# Altium schematic sheet ECG.SchDoc
size A4; SheetNumber: 4; SheetTotal: 7
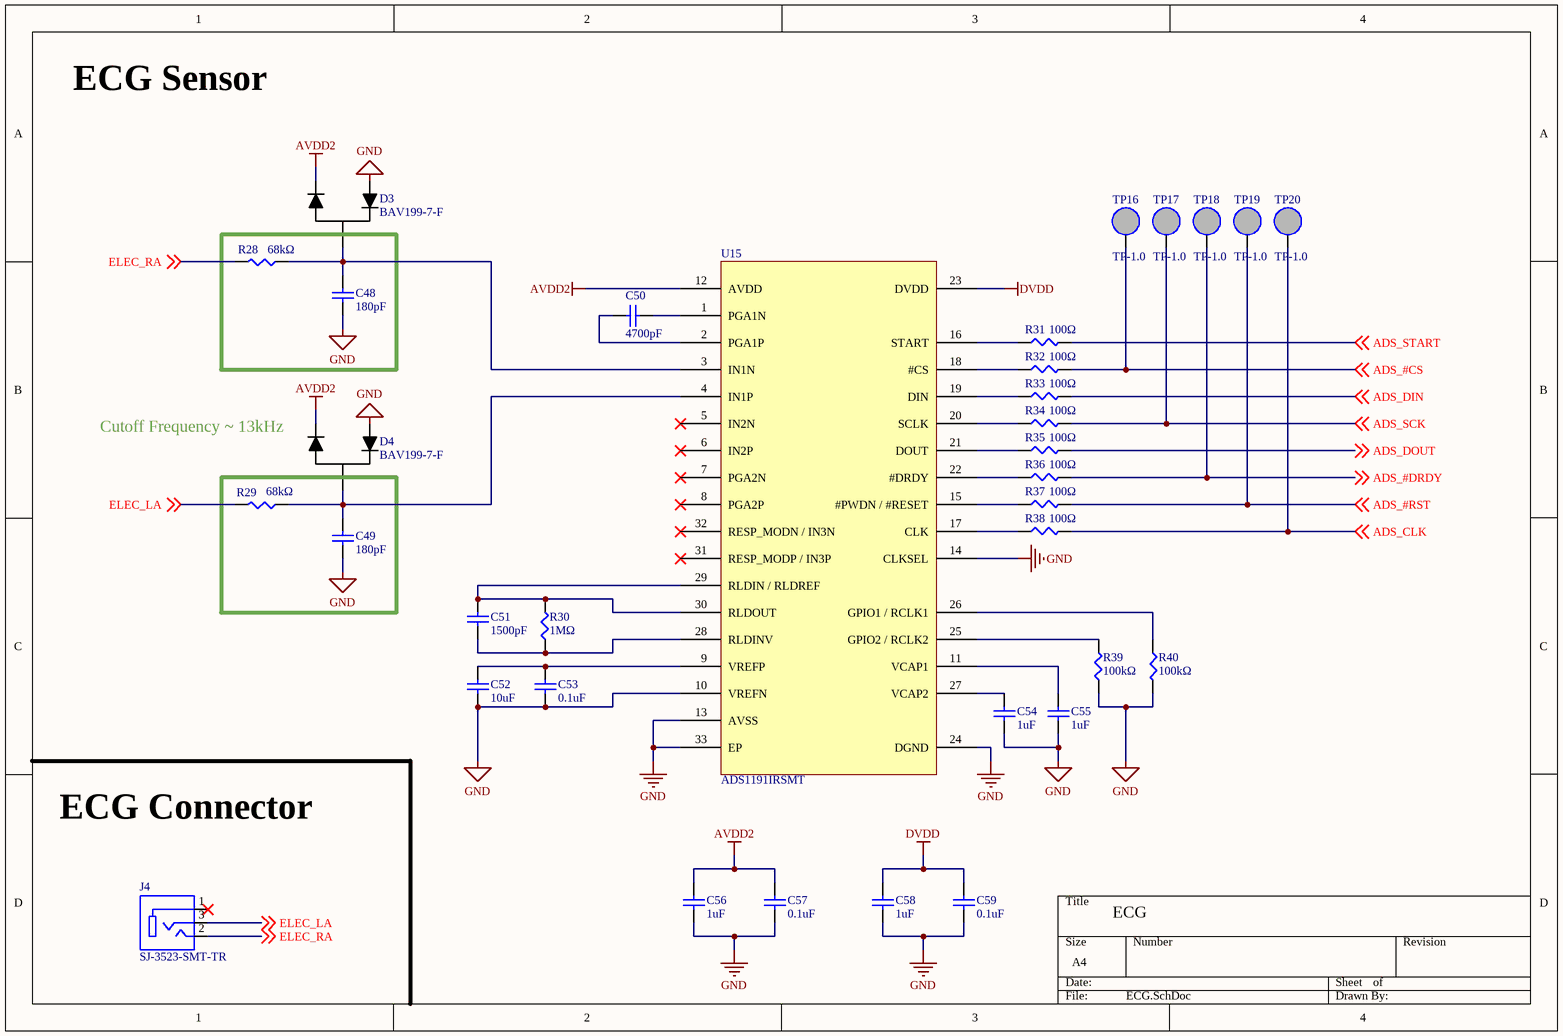
[diagram p0: ECG.SchDoc]

## Parts
C48  180pF  [0402]
C49  180pF  [0402]
C50  4700pF  [0402]
C51  1500pF  [0402]
C52  10uF  [0603]
C53  0.1uF  [0402]
C54  1uF  [0402]
C55  1uF  [0402]
C56  1uF  [0402]
C57  0.1uF  [0402]
C58  1uF  [0402]
C59  0.1uF  [0402]
D3  BAV199-7-F  [SOT-23]
D4  BAV199-7-F  [SOT-23]
J4  SJ-3523-SMT-TR  [CUI_SJ-3523-SMT-TR]
R28  68kΩ  [0402]
R29  68kΩ  [0402]
R30  1MΩ  [0402]
R31  100Ω  [0402]
R32  100Ω  [0402]
R33  100Ω  [0402]
R34  100Ω  [0402]
R35  100Ω  [0402]
R36  100Ω  [0402]
R37  100Ω  [0402]
R38  100Ω  [0402]
R39  100kΩ  [0402]
R40  100kΩ  [0402]
TP16  TP-1.0  [Testpoint]  (no BOM)
TP17  TP-1.0  [Testpoint]  (no BOM)
TP18  TP-1.0  [Testpoint]  (no BOM)
TP19  TP-1.0  [Testpoint]  (no BOM)
TP20  TP-1.0  [Testpoint]  (no BOM)
U15  ADS1191IRSMT  [VQFN-32]

## Nets
AVDD2: C56.2 C57.2 D3.3(Cathode) D4.3(Cathode) U15.12(AVDD)
DVDD: C58.2 C59.2 U15.23(DVDD)
GND: C48.1 C49.1 C52.1 C53.1 C54.2 C55.2 C56.1 C57.1 C58.1 C59.1 D3.2(Anode) D4.2(Anode) R39.1 R40.2 U15.10(VREFN) U15.13(AVSS) U15.14(CLKSEL) U15.24(DGND) U15.33(EP)
ADS_#CS: R32.2 TP16.1 ; off-sheet ADS_#CS
ADS_#DRDY: R36.2 TP18.1 ; off-sheet ADS_#DRDY
ADS_#RST: R37.2 TP19.1 ; off-sheet ADS_#RST
ADS_CLK: R38.2 TP20.1 ; off-sheet ADS_CLK
ADS_DIN: R33.2 ; off-sheet ADS_DIN
ADS_DOUT: R35.2 ; off-sheet ADS_DOUT
ADS_SCK: R34.2 TP17.1 ; off-sheet ADS_SCK
ADS_START: R31.2 ; off-sheet ADS_START
ELEC_LA: J4.3 R29.2 ; off-sheet ELEC_LA
ELEC_RA: J4.2 R28.2 ; off-sheet ELEC_RA
NetC48_2: C48.2 D3.1(Common) R28.1 U15.3(IN1N)
NetC49_2: C49.2 D4.1(Common) R29.1 U15.4(IN1P)
NetC50_1: C50.1 U15.2(PGA1P)
NetC50_2: C50.2 U15.1(PGA1N)
NetC51_1: C51.1 R30.1 U15.28(RLDINV)
NetC51_2: C51.2 R30.2 U15.29(RLDIN_/_RLDREF) U15.30(RLDOUT)
NetC52_2: C52.2 C53.2 U15.9(VREFP)
NetC54_1: C54.1 U15.27(VCAP2)
NetC55_1: C55.1 U15.11(VCAP1)
NetR31_1: R31.1 U15.16(START)
NetR32_1: R32.1 U15.18(#CS)
NetR33_1: R33.1 U15.19(DIN)
NetR34_1: R34.1 U15.20(SCLK)
NetR35_1: R35.1 U15.21(DOUT)
NetR36_1: R36.1 U15.22(#DRDY)
NetR37_1: R37.1 U15.15(#PWDN_/_#RESET)
NetR38_1: R38.1 U15.17(CLK)
NetR39_2: R39.2 U15.25(GPIO2_/_RCLK2)
NetR40_1: R40.1 U15.26(GPIO1_/_RCLK1)

Not connected (* = marked no-connect by the designer): J4 1*; U15 5(IN2N)* 6(IN2P)* 7(PGA2N)* 8(PGA2P)* 31(RESP_MODP_/_IN3P)* 32(RESP_MODN_/_IN3N)*

## Notes on the sheet
- ECG Sensor
- (near D4) Cutoff Frequency ~ 13kHz
- ECG Connector
- ECG

## Library data of the parts
C48-C51 C53-C59 = 0402: MLCC-0402
C52 = 0603: MLCC-0603
D3 D4 = BAV199-7-F: Dual Surface Mount Low Leakage Diode
J4 = SJ-3523-SMT-TR: 3.5 mm, Stereo, Right Angle, Surface Mount _SMT_, Audio Jack Connector; MF: CUI Devices; Package: LGA-10 STMicroelectronics; CUI_purchase_URL: https://www.cuidevices.com/product/interconnect/connectors/audio-connectors/jacks/sj-352x-smt-series?utm_source=snapeda.com&utm_medium=referral&utm_campaign=snapedaBOM; Value: *; Price: None; MP: SJ-3523-SMT-TR; Availability: Unavailable; SnapEDA_Link: https://www.snapeda.com/parts/SJ-3523-SMT-TR/CUI%20Devices/view-part/251570/?ref=snap
R28-R40 = 0402: Resistor_SMD_0402; AuthorBy: yjlab
TP16-TP20 = Testpoint
U15 = ADS1191IRSMT: Biopotential Measurement ADC, 2 Channel, 16 Bit